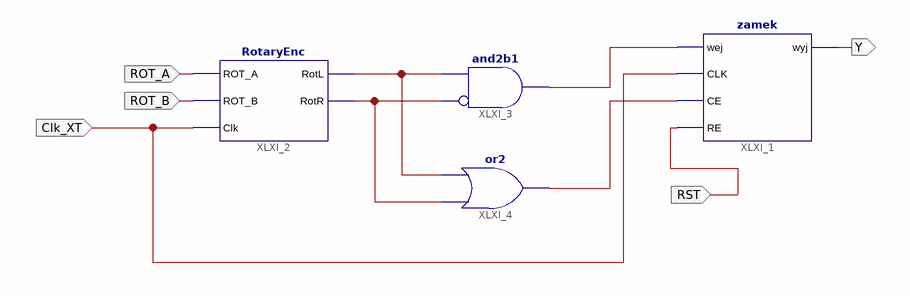
[diagram p0: schematic sheet 1]
// Xilinx ISE schematic zamek_schemat.sch (aspartan6) as structural Verilog: 4 symbols, 5 ports
module zamek_schemat (
  input  ROT_A,
  input  ROT_B,
  input  Clk_XT,
  input  RST,
  output Y
);

  wire XLXN_7, XLXN_8, XLXN_9, XLXN_12;

  zamek XLXI_1 (.wej(XLXN_9), .CLK(Clk_XT), .CE(XLXN_12), .RE(RST), .wyj(Y));
  RotaryEnc XLXI_2 (.ROT_A(ROT_A), .ROT_B(ROT_B), .RotL(XLXN_7), .RotR(XLXN_8), .Clk(Clk_XT));
  and XLXI_3 (XLXN_9, ~XLXN_8, XLXN_7);  // and2b1
  or XLXI_4 (XLXN_12, XLXN_8, XLXN_7);
endmodule
